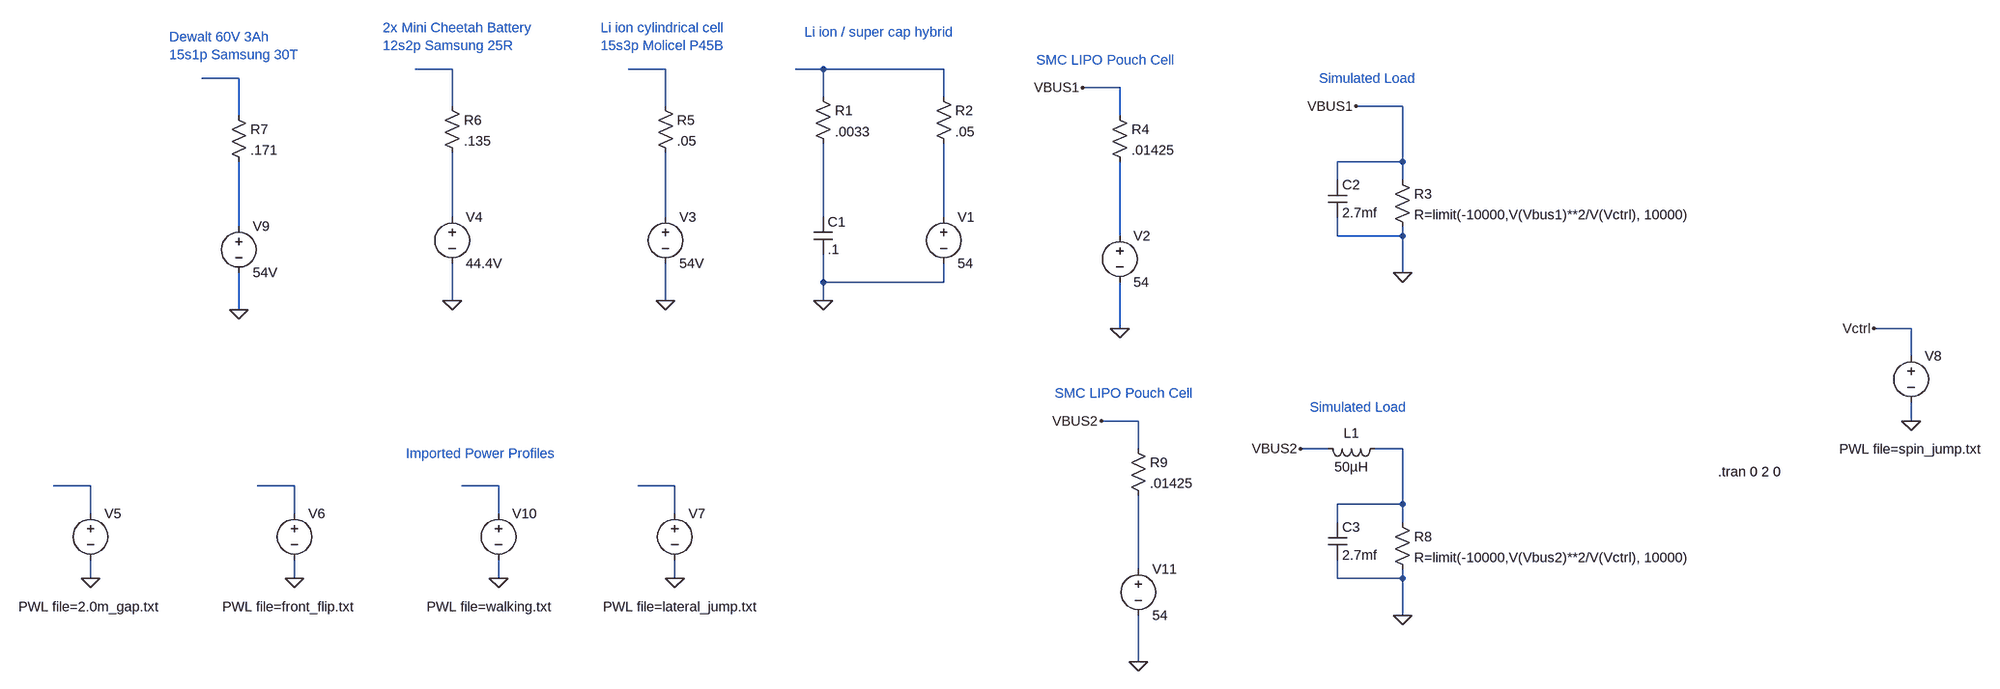
[diagram p0: schematic simulation.asc]
simulation.asc, the LTspice schematic file:
Version 4
SHEET 1 2380 904
WIRE -896 -576 -960 -576
WIRE -528 -576 -592 -576
WIRE -256 -576 -304 -576
WIRE -48 -576 -256 -576
WIRE -1264 -560 -1328 -560
WIRE 544 -544 480 -544
WIRE -256 -528 -256 -576
WIRE -48 -528 -48 -576
WIRE -896 -512 -896 -576
WIRE -528 -512 -528 -576
WIRE 1120 -512 1040 -512
WIRE -1264 -496 -1264 -560
WIRE 544 -496 544 -544
WIRE 1120 -416 1120 -512
WIRE 1120 -416 1008 -416
WIRE 1008 -384 1008 -416
WIRE 1120 -384 1120 -416
WIRE -896 -320 -896 -432
WIRE -528 -320 -528 -432
WIRE -256 -320 -256 -448
WIRE -48 -320 -48 -448
WIRE -1264 -304 -1264 -416
WIRE 544 -288 544 -416
WIRE 1008 -288 1008 -320
WIRE 1120 -288 1120 -304
WIRE 1120 -288 1008 -288
WIRE 1120 -224 1120 -288
WIRE -256 -208 -256 -256
WIRE -48 -208 -48 -240
WIRE -48 -208 -256 -208
WIRE -896 -176 -896 -240
WIRE -528 -176 -528 -240
WIRE -256 -176 -256 -208
WIRE -1264 -160 -1264 -224
WIRE 544 -128 544 -208
WIRE 2224 -128 2160 -128
WIRE 2224 -80 2224 -128
WIRE 576 32 512 32
WIRE 2224 32 2224 0
WIRE 576 80 576 32
WIRE 992 80 944 80
WIRE 1120 80 1072 80
WIRE -1520 144 -1584 144
WIRE -1168 144 -1232 144
WIRE -816 144 -880 144
WIRE -512 144 -576 144
WIRE 1120 176 1120 80
WIRE 1120 176 1008 176
WIRE -1520 192 -1520 144
WIRE -1168 192 -1168 144
WIRE -816 192 -816 144
WIRE -512 192 -512 144
WIRE 1008 208 1008 176
WIRE 1120 208 1120 176
WIRE 576 288 576 160
WIRE -1520 304 -1520 272
WIRE -1168 304 -1168 272
WIRE -816 304 -816 272
WIRE -512 304 -512 272
WIRE 1008 304 1008 272
WIRE 1120 304 1120 288
WIRE 1120 304 1008 304
WIRE 1120 368 1120 304
WIRE 576 448 576 368
FLAG -256 -176 0
FLAG 1120 -224 0
FLAG 544 -128 0
FLAG -528 -176 0
FLAG 1040 -512 VBUS1
FLAG -1520 304 0
FLAG 480 -544 VBUS1
FLAG -1168 304 0
FLAG -512 304 0
FLAG 2224 32 0
FLAG -896 -176 0
FLAG -1264 -160 0
FLAG -816 304 0
FLAG 2160 -128 Vctrl
FLAG 1120 368 0
FLAG 944 80 VBUS2
FLAG 576 448 0
FLAG 512 32 VBUS2
SYMBOL cap -272 -320 R0
SYMATTR InstName C1
SYMATTR Value .1
SYMBOL voltage -48 -336 R0
WINDOW 123 0 0 Left 0
WINDOW 39 0 0 Left 0
SYMATTR InstName V1
SYMATTR Value 54
SYMBOL res -272 -544 R0
SYMATTR InstName R1
SYMATTR Value .0033
SYMBOL res -64 -544 R0
SYMATTR InstName R2
SYMATTR Value .05
SYMBOL res 1104 -400 R0
SYMATTR InstName R3
SYMATTR Value R=limit(-10000,V(Vbus1)**2/V(Vctrl), 10000)
SYMBOL voltage 544 -304 R0
WINDOW 123 0 0 Left 0
WINDOW 39 0 0 Left 0
SYMATTR InstName V2
SYMATTR Value 54
SYMBOL res 528 -512 R0
SYMATTR InstName R4
SYMATTR Value .01425
SYMBOL voltage -528 -336 R0
WINDOW 123 0 0 Left 0
WINDOW 39 0 0 Left 0
SYMATTR InstName V3
SYMATTR Value 54V
SYMBOL res -544 -528 R0
SYMATTR InstName R5
SYMATTR Value .05
SYMBOL cap 992 -384 R0
SYMATTR InstName C2
SYMATTR Value 2.7mf
SYMBOL voltage -1520 176 R0
WINDOW 123 0 0 Left 0
WINDOW 39 0 0 Left 0
WINDOW 3 -124 177 Left 2
SYMATTR Value PWL file=2.0m_gap.txt
SYMATTR InstName V5
SYMBOL voltage -1168 176 R0
WINDOW 123 0 0 Left 0
WINDOW 39 0 0 Left 0
WINDOW 3 -124 177 Left 2
SYMATTR Value PWL file=front_flip.txt
SYMATTR InstName V6
SYMBOL voltage -512 176 R0
WINDOW 123 0 0 Left 0
WINDOW 39 0 0 Left 0
WINDOW 3 -124 177 Left 2
SYMATTR Value PWL file=lateral_jump.txt
SYMATTR InstName V7
SYMBOL voltage 2224 -96 R0
WINDOW 123 0 0 Left 0
WINDOW 39 0 0 Left 0
WINDOW 3 -124 177 Left 2
SYMATTR Value PWL file=spin_jump.txt
SYMATTR InstName V8
SYMBOL voltage -896 -336 R0
WINDOW 123 0 0 Left 0
WINDOW 39 0 0 Left 0
SYMATTR InstName V4
SYMATTR Value 44.4V
SYMBOL res -912 -528 R0
SYMATTR InstName R6
SYMATTR Value .135
SYMBOL voltage -1264 -320 R0
WINDOW 123 0 0 Left 0
WINDOW 39 0 0 Left 0
SYMATTR InstName V9
SYMATTR Value 54V
SYMBOL res -1280 -512 R0
SYMATTR InstName R7
SYMATTR Value .171
SYMBOL voltage -816 176 R0
WINDOW 123 0 0 Left 0
WINDOW 39 0 0 Left 0
WINDOW 3 -124 177 Left 2
SYMATTR Value PWL file=walking.txt
SYMATTR InstName V10
SYMBOL res 1104 192 R0
SYMATTR InstName R8
SYMATTR Value R=limit(-10000,V(Vbus2)**2/V(Vctrl), 10000)
SYMBOL cap 992 208 R0
SYMATTR InstName C3
SYMATTR Value 2.7mf
SYMBOL voltage 576 272 R0
WINDOW 123 0 0 Left 0
WINDOW 39 0 0 Left 0
SYMATTR InstName V11
SYMATTR Value 54
SYMBOL res 560 64 R0
SYMATTR InstName R9
SYMATTR Value .01425
SYMBOL ind 1088 64 R90
WINDOW 0 5 56 VBottom 2
WINDOW 3 32 56 VTop 2
SYMATTR InstName L1
SYMATTR Value 50µH
TEXT 1664 120 Left 2 !.tran 0 2 0
TEXT 400 -592 Left 2 ;SMC LIPO Pouch Cell
TEXT -288 -640 Left 2 ;Li ion / super cap hybrid
TEXT -640 -648 Left 2 ;Li ion cylindrical cell\n15s3p Molicel P45B
TEXT 976 -560 Left 2 ;Simulated Load
TEXT -976 88 Left 2 ;Imported Power Profiles
TEXT -1016 -648 Left 2 ;2x Mini Cheetah Battery\n12s2p Samsung 25R
TEXT -1384 -632 Left 2 ;Dewalt 60V 3Ah\n15s1p Samsung 30T
TEXT 960 8 Left 2 ;Simulated Load
TEXT 432 -16 Left 2 ;SMC LIPO Pouch Cell

The netlist it stands for:
* simulation.asc
C1 N007 0 .1
V1 N008 0 54
R1 N003 N007 .0033
R2 N003 N008 .05
R3 VBUS1 0 R=limit(-10000,V(Vbus1)**2/V(Vctrl), 10000)
V2 N010 0 54
R4 VBUS1 N010 .01425
V3 N006 0 54V
R5 N002 N006 .05
C2 VBUS1 0 2.7mf
V5 N012 0 PWL file=2.0m_gap.txt
V6 N013 0 PWL file=front_flip.txt
V7 N015 0 PWL file=lateral_jump.txt
V8 Vctrl 0 PWL file=spin_jump.txt
V4 N005 0 44.4V
R6 N001 N005 .135
V9 N009 0 54V
R7 N004 N009 .171
V10 N014 0 PWL file=walking.txt
R8 N011 0 R=limit(-10000,V(Vbus2)**2/V(Vctrl), 10000)
C3 N011 0 2.7mf
V11 N016 0 54
R9 VBUS2 N016 .01425
L1 N011 VBUS2 50µH
.tran 0 2 0
* SMC LIPO Pouch Cell
* Li ion / super cap hybrid
* Li ion cylindrical cell
* 15s3p Molicel P45B
* Simulated Load
* Imported Power Profiles
* 2x Mini Cheetah Battery
* 12s2p Samsung 25R
* Dewalt 60V 3Ah
* 15s1p Samsung 30T
* Simulated Load
* SMC LIPO Pouch Cell
.backanno
.end

* Results of the author's LTspice run, read from the files saved beside the schematic
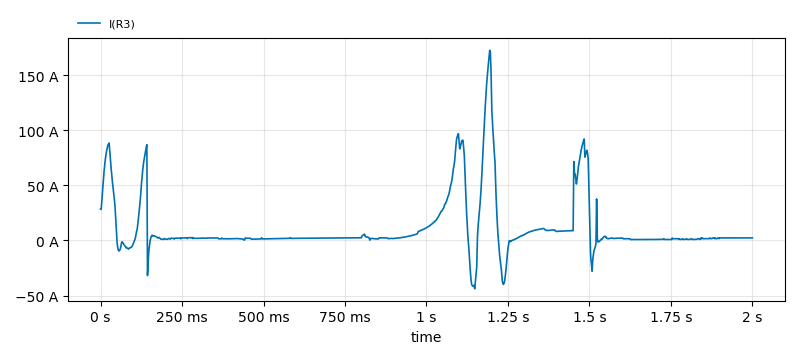
[diagram p1: Transient Analysis of simulation.asc, plotted from the saved traces]
* Transient Analysis, 1 run:
*   I(R3): min -43.87 A, max 172.5 A, average 10.63 A, rms 28.77 A, last 2.315 A